# Altium schematic sheet MCPEmulate1.SchDoc
size A4; SheetNumber: 4; SheetTotal: 4
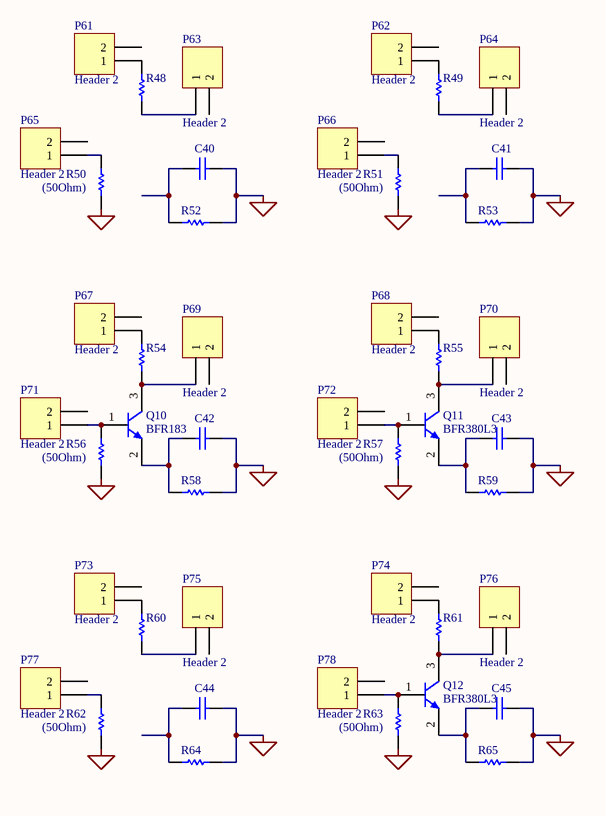
[diagram p0: MCPEmulate1.SchDoc]

## Parts
C40  (no value)  [CAPC2013X140X45NL15T25]
C41  (no value)  [CAPC2013X140X45NL15T25]
C42  (no value)  [CAPC2013X140X45NL15T25]
C43  (no value)  [CAPC2013X140X45NL15T25]
C44  (no value)  [CAPC2013X140X45NL15T25]
C45  (no value)  [CAPC2013X140X45NL15T25]
P61  Header 2  [HDR1X2]
P62  Header 2  [HDR1X2]
P63  Header 2  [HDR1X2]
P64  Header 2  [HDR1X2]
P65  Header 2  [HDR1X2]
P66  Header 2  [HDR1X2]
P67  Header 2  [HDR1X2]
P68  Header 2  [HDR1X2]
P69  Header 2  [HDR1X2]
P70  Header 2  [HDR1X2]
P71  Header 2  [HDR1X2]
P72  Header 2  [HDR1X2]
P73  Header 2  [HDR1X2]
P74  Header 2  [HDR1X2]
P75  Header 2  [HDR1X2]
P76  Header 2  [HDR1X2]
P77  Header 2  [HDR1X2]
P78  Header 2  [HDR1X2]
Q10  BFR183  [INF-SOT23_M]
Q11  BFR380L3  [INF-TSLP-3-1_V]
Q12  BFR380L3  [INF-TSLP-3-1_V]
R48  (no value)  [RESC1005X40X25NL05T10]
R49  (no value)  [RESC1005X40X25NL05T10]
R50  (50Ohm)  [RESC1005X40X25NL05T10]
R51  (50Ohm)  [RESC1005X40X25NL05T10]
R52  (no value)  [RESC1005X40X25NL05T10]
R53  (no value)  [RESC1005X40X25NL05T10]
R54  (no value)  [RESC1005X40X25NL05T10]
R55  (no value)  [RESC1005X40X25NL05T10]
R56  (50Ohm)  [RESC1005X40X25NL05T10]
R57  (50Ohm)  [RESC1005X40X25NL05T10]
R58  (no value)  [RESC1005X40X25NL05T10]
R59  (no value)  [RESC1005X40X25NL05T10]
R60  (no value)  [RESC1005X40X25NL05T10]
R61  (no value)  [RESC1005X40X25NL05T10]
R62  (50Ohm)  [RESC1005X40X25NL05T10]
R63  (50Ohm)  [RESC1005X40X25NL05T10]
R64  (no value)  [RESC1005X40X25NL05T10]
R65  (no value)  [RESC1005X40X25NL05T10]

## Nets
GND: C40.1 C41.1 C42.1 C43.1 C44.1 C45.1 R50.1 R51.1 R52.1 R53.1 R56.1 R57.1 R58.1 R59.1 R62.1 R63.1 R64.1 R65.1
NetC40_2: C40.2 R52.2
NetC41_2: C41.2 R53.2
NetC42_2: C42.2 Q10.2(E) R58.2
NetC43_2: C43.2 Q11.2(E) R59.2
NetC44_2: C44.2 R64.2
NetC45_2: C45.2 Q12.2(E) R65.2
NetP61_1: P61.1 R48.1
NetP62_1: P62.1 R49.1
NetP63_1: P63.1 R48.2
NetP64_1: P64.1 R49.2
NetP65_1: P65.1 R50.2
NetP66_1: P66.1 R51.2
NetP67_1: P67.1 R54.1
NetP68_1: P68.1 R55.1
NetP69_1: P69.1 Q10.3(C) R54.2
NetP70_1: P70.1 Q11.3(C) R55.2
NetP71_1: P71.1 Q10.1(B) R56.2
NetP72_1: P72.1 Q11.1(B) R57.2
NetP73_1: P73.1 R60.1
NetP74_1: P74.1 R61.1
NetP75_1: P75.1 R60.2
NetP76_1: P76.1 Q12.3(C) R61.2
NetP77_1: P77.1 R62.2
NetP78_1: P78.1 Q12.1(B) R63.2

Not connected (* = marked no-connect by the designer): P61 2; P62 2; P63 2; P64 2; P65 2; P66 2; P67 2; P68 2; P69 2; P70 2; P71 2; P72 2; P73 2; P74 2; P75 2; P76 2; P77 2; P78 2

## Library data of the parts
C40-C45 = CMP-2007-03395-1: 0402; Part Number: GRM21BR71A106KE51L; Manufacturer: Murata
P61-P78 = Header 2: Header, 2-Pin; LatestRevisionDate: 17-Jul-2002; LatestRevisionNote: Re-released for DXP Platform.; Publisher: Altium Limited
Q10 = CMP-1191-00006-1: NPN Silicon RF Transistor, 12 V VCEO, 65 mA IC, 17.5 dB Gmax, SOT23, Green; Manufacturer: Infineon; Group: For low frequencies e.g. VHF/UHF; Green: yes; VCEO (max): 12 V; NFmin (typ): 0.9 dB; Ptot (max): 450mW; Gmax (typ): 17.5 dB; IC (max): 65 mA; PartNumber: BFR183; ComponentLink1Description: Manufacturer URL; ComponentLink2URL: http://www.infineon.com/dgdl/bfr183.pdf?folderId=db3a30431400ef68011425b1354605c1&fileId=db3a30431400ef68011426a1b8f80656&location=en.Products.RF.RF_Transistors_.Low_Noise_Si_Transistors_up_to_2_5_GHz.DATASHEET.bfr183.pdf; ComponentLink2Description: Datasheet; ComponentLink3Description: Package Specification; ComponentLink1URL: http://www.infineon.com/; Mounting Technology: Surface Mount; DatasheetVersion: Mar-2007; PackageReference: SOT23; ComponentLink3URL: http://www.infineon.com/dgdl/SOT23-Package_Overview.pdf?folderId=db3a30431936bc4b0119532290053c66&fileId=db3a30431936bc4b0119533468123c85; PackageDescription: 3-Pin Small Outline Transistor Package, 1.3 x 2.9 mm Body, 0.95 mm Pitch
Q11 Q12 = CMP-1189-00019-1: NPN Silicon RF Transistor, 6 V VCEO, 80 mA IC, 13.5 dB Gmax, TSLP-3-1, Green; Manufacturer: Infineon; Green: yes; Gmax (typ): 13.5 dB; IC (max): 80 mA; Ptot (max): 380.0 mW; NFmin (typ): 1.1 dB; VCEO (max): 6 V; Group: Si transistors with high gain up to 2.5 GHz; ComponentLink3URL: http://www.infineon.com/dgdl/TSLP-3-1-Package_Overview.pdf?folderId=db3a30431936bc4b011957434db737d2&fileId=db3a30431936bc4b0119577ed2783818; PartNumber: BFR380L3; PackageReference: TSLP-3-1; Halogen-free: yes; PackageDescription: 3-Pin Thin Small Leadless Package, 0.6 x 1 mm Body; ComponentLink2URL: http://www.infineon.com/dgdl/bfr380l3.pdf?folderId=db3a30431400ef68011425b2dfaf05c6&fileId=db3a30431400ef6801142725593e06e5&location=en.Products.RF.RF_Transistors_.High_Linearity_Si-_and_SiGe_C-Transistors_for_use_up_to_6_GHz.DATASHEET.bfr380l3.pdf; ComponentLink1URL: http://www.infineon.com/; ComponentLink2Description: Datasheet; Mounting Technology: Surface Mount; ComponentLink3Description: Package Specification; ComponentLink1Description: Manufacturer URL; DatasheetVersion: ########
R48-R65 = CMP-2002-07472-1: 0402; Part Number: RC0402FR-071KL; Manufacturer: Yageo / Phycomp